# EAGLE design cdf-dual-driver (EAGLE 7.3.0)
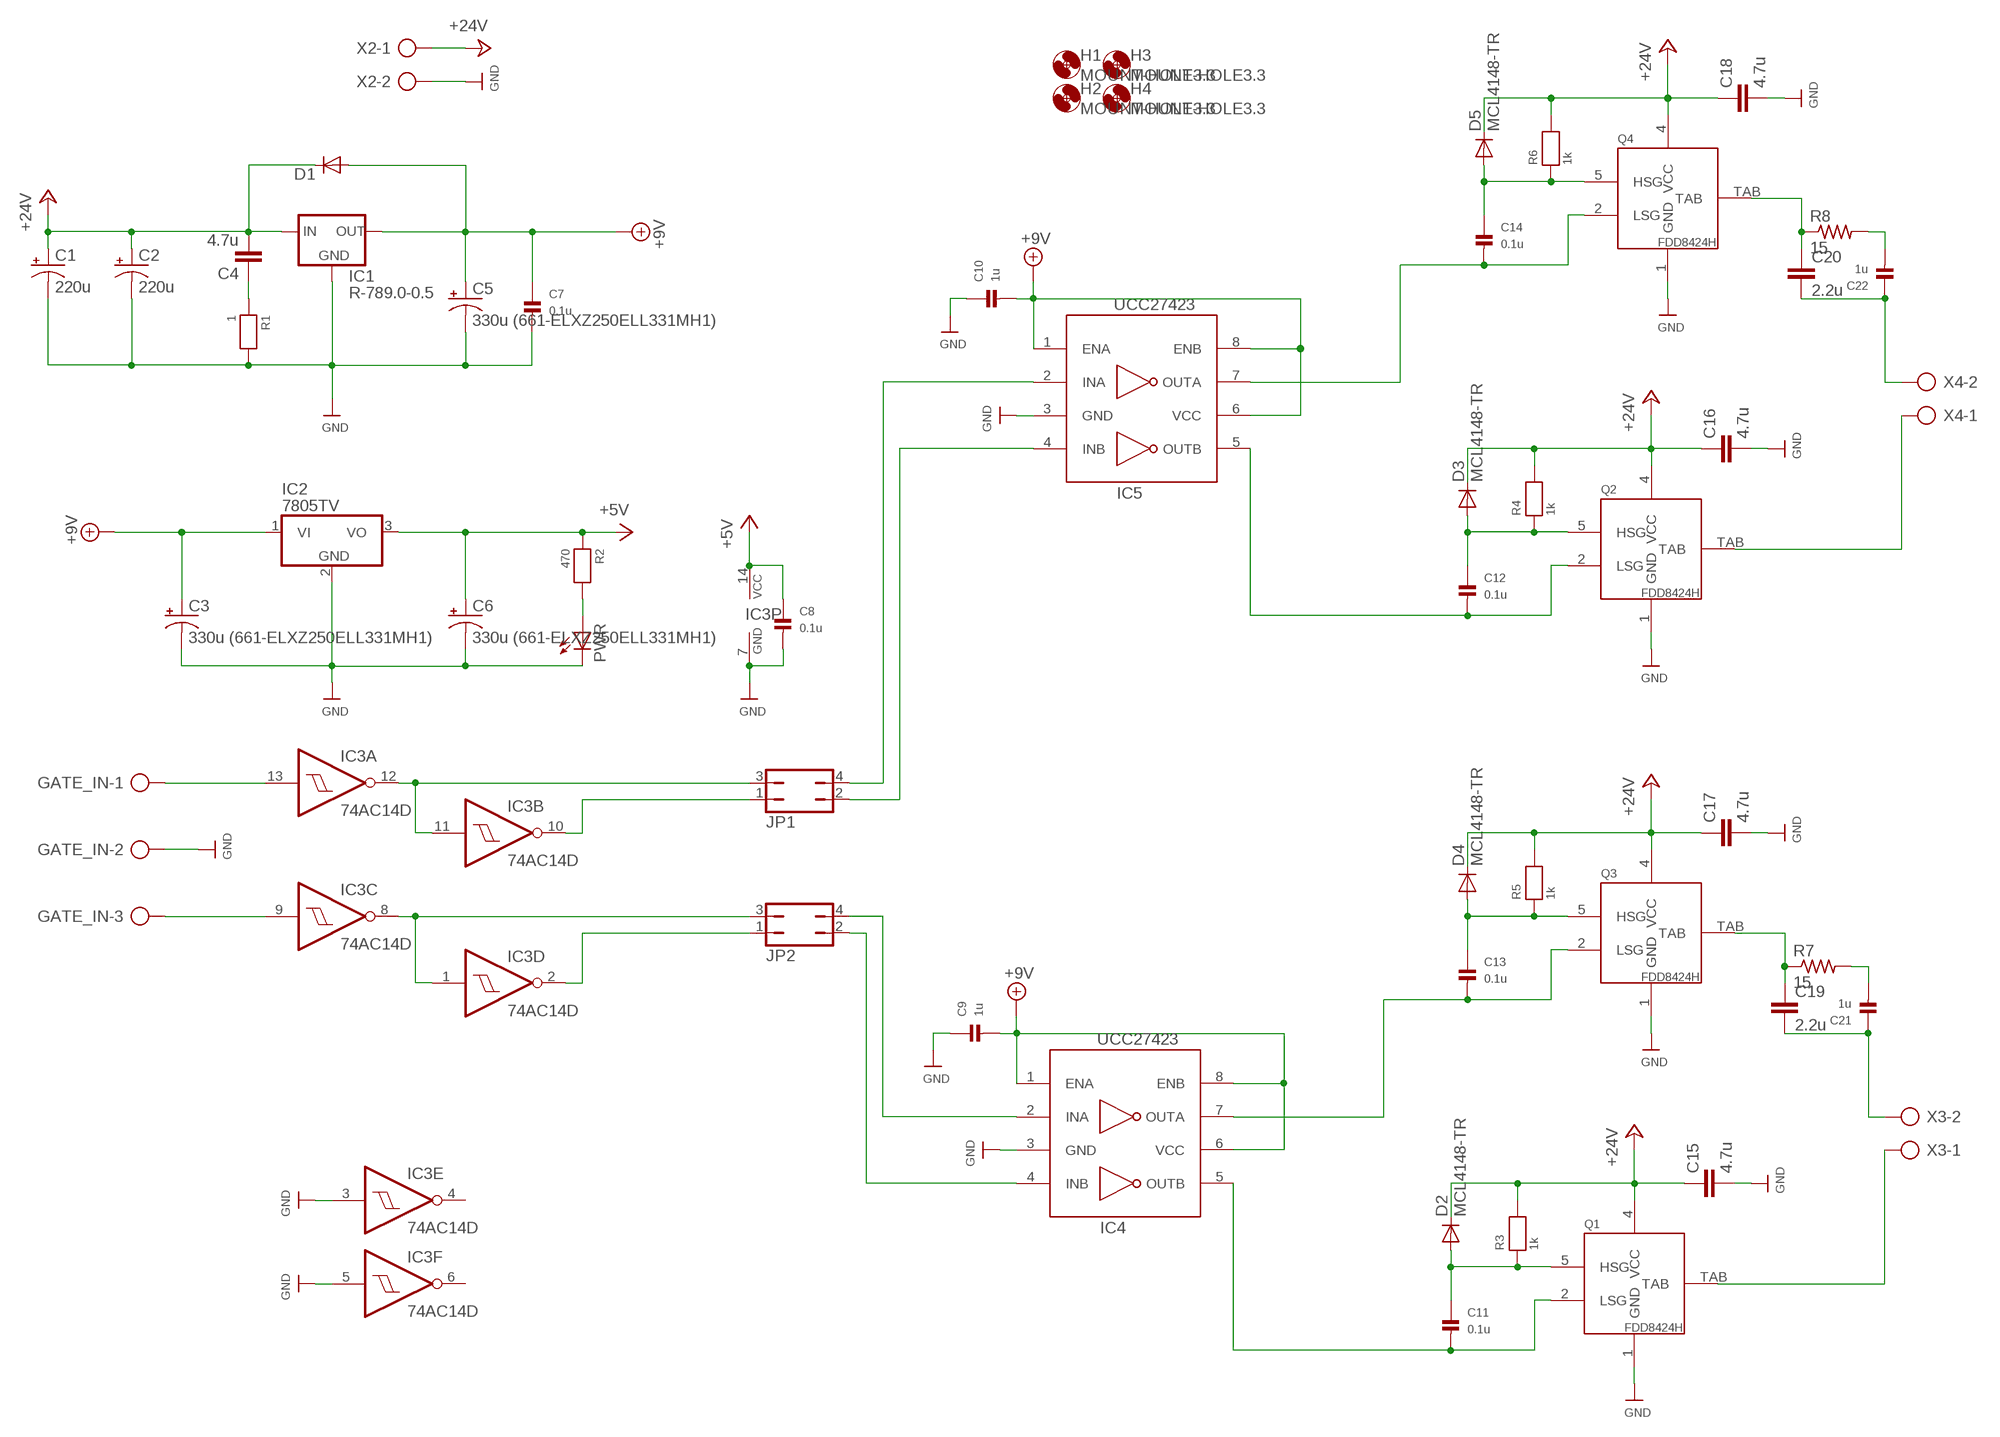
[diagram p0: schematic, sheet 1]

## Parts
C1  220u  CPOL-USE3.5-8  [E3,5-8]
C2  220u  CPOL-USE3.5-8  [E3,5-8]
C3  330u (661-ELXZ250ELL331MH1)  CPOL-USE3.5-8  [E3,5-8]
C4  4.7u  C-EUC1210  [C1210]
C5  330u (661-ELXZ250ELL331MH1)  CPOL-USE3.5-8  [E3,5-8]
C6  330u (661-ELXZ250ELL331MH1)  CPOL-USE3.5-8  [E3,5-8]
C7  0.1u  CAP_CERAMIC0805  [0805]
C8  0.1u  CAP_CERAMIC0805  [0805]
C9  1u  CAP_CERAMIC1206  [1206]
C10  1u  CAP_CERAMIC1206  [1206]
C11  0.1u  CAP_CERAMIC0805  [0805]
C12  0.1u  CAP_CERAMIC0805  [0805]
C13  0.1u  CAP_CERAMIC0805  [0805]
C14  0.1u  CAP_CERAMIC0805  [0805]
C15  4.7u  C-EUC1210  [C1210]
C16  4.7u  C-EUC1210  [C1210]
C17  4.7u  C-EUC1210  [C1210]
C18  4.7u  C-EUC1210  [C1210]
C19  2.2u  C-EUC1210  [C1210]
C20  2.2u  C-EUC1210  [C1210]
C21  1u  CAP_CERAMIC1206  [1206]
C22  1u  CAP_CERAMIC1206  [1206]
D1  DIODE-SOD123  [SOD123]
D2  MCL4148-TR  DIODE-MICROMELF-W  [MICROMELF-W]
D3  MCL4148-TR  DIODE-MICROMELF-W  [MICROMELF-W]
D4  MCL4148-TR  DIODE-MICROMELF-W  [MICROMELF-W]
D5  MCL4148-TR  DIODE-MICROMELF-W  [MICROMELF-W]
GATE_IN  AK500/3  [AK500/3]
H1  MOUNT-HOLE3.3  [3,3]
H2  MOUNT-HOLE3.3  [3,3]
H3  MOUNT-HOLE3.3  [3,3]
H4  MOUNT-HOLE3.3  [3,3]
IC1  R-789.0-0.5  [SIP3]
IC2  7805TV  [TO220V]
IC3  74AC14D  [SO14]
IC4  UCC27423  [SOIC8]
IC5  UCC27423  [SOIC8]
JP1  JP2Q  [JP2Q]
JP2  JP2Q  [JP2Q]
PWR  LED5MM  [LED5MM]
Q1  FDD8424H  [TO252-4]
Q2  FDD8424H  [TO252-4]
Q3  FDD8424H  [TO252-4]
Q4  FDD8424H  [TO252-4]
R1  1  RESISTOR0805  [0805]
R2  470  RESISTOR0805  [0805]
R3  1k  RESISTOR0805  [0805]
R4  1k  RESISTOR0805  [0805]
R5  1k  RESISTOR0805  [0805]
R6  1k  RESISTOR0805  [0805]
R7  15  R-US_R1210  [R1210]
R8  15  R-US_R1210  [R1210]
X2  AK500/2  [AK500/2]
X3  AK500/2  [AK500/2]
X4  AK500/2  [AK500/2]

## Nets
+5V: C6.+ C8.1 IC2.3(VO) IC3.14(P:VCC) R2.1
+9V: C3.+ C5.+ C7.1 C9.2 C10.2 D1.A IC1.3(OUT) IC2.1(VI) IC4.1(ENA) IC4.6(VCC) IC4.8(ENB) IC5.1(ENA) IC5.6(VCC) IC5.8(ENB)
+24V: C1.+ C2.+ C4.2 C15.1 C16.1 C17.1 C18.1 D1.C D2.C D3.C D4.C D5.C IC1.1(IN) Q1.4(VCC) Q2.4(VCC) Q3.4(VCC) Q4.4(VCC) R3.2 R4.2 R5.2 R6.2 X2.1
GND: C1.- C2.- C3.- C5.- C6.- C7.2 C8.2 C9.1 C10.1 C15.2 C16.2 C17.2 C18.2 GATE_IN.2 IC1.2(GND) IC2.2(GND) IC3.3(E:I) IC3.5(F:I) IC3.7(P:GND) IC4.3(GND) IC5.3(GND) PWR.K(C) Q1.1(GND) Q2.1(GND) Q3.1(GND) Q4.1(GND) R1.2 X2.2
N$1: C13.2 IC4.7(OUTA) Q3.2(LSG)
N$2: C13.1 D4.A Q3.5(HSG) R5.1
N$3: C14.2 IC5.7(OUTA) Q4.2(LSG)
N$4: C14.1 D5.A Q4.5(HSG) R6.1
N$5: C20.1 Q4.TAB R8.1
N$6: C22.2 R8.2
N$7: C20.2 C22.1 X4.2
N$8: C12.2 IC5.5(OUTB) Q2.2(LSG)
N$9: C12.1 D3.A Q2.5(HSG) R4.1
N$10: Q2.TAB X4.1
N$11: C4.1 R1.1
N$12: C19.1 Q3.TAB R7.1
N$13: C21.2 R7.2
N$14: C19.2 C21.1 X3.2
N$15: C11.2 IC4.5(OUTB) Q1.2(LSG)
N$16: C11.1 D2.A Q1.5(HSG) R3.1
N$17: Q1.TAB X3.1
N$18: PWR.A R2.2
N$19: IC5.2(INA) JP1.4
N$20: IC5.4(INB) JP1.2
N$21: IC4.2(INA) JP2.4
N$22: IC4.4(INB) JP2.2
N$23: IC3.11(B:I) IC3.12(A:O) JP1.3
N$24: GATE_IN.1 IC3.13(A:I)
N$25: GATE_IN.3 IC3.9(C:I)
N$26: IC3.10(B:O) JP1.1
N$27: IC3.1(D:I) IC3.8(C:O) JP2.3
N$28: IC3.2(D:O) JP2.1
Unconnected: IC3.4(E:O) IC3.6(F:O)

## Library data of the parts
C1-C3 C5 C6 = rcl:CPOL-US: POLARIZED CAPACITOR, American symbol
C4 C15-C20 = rcl:C-EU: CAPACITOR, European symbol
C7-C14 C21 C22 = microbuilder:CAP_CERAMIC: Ceramic Capacitors 0402 - 0402 Surface Mount Capacitors 16pF 50V 5% [Digikey: 445-4899-2-ND] 18pF 50V 5% [Digikey: 490-1281-2-ND] 22pF 50V 5% [Digikey: 490-1283-2-ND] 68pF 50V 5% [Digikey: 490-1289-2-ND] 0.1uF 10V 10% [Digikey: 490-1318-2-ND] 1.0uF 6.3V 10% [Digikey: 490-1320-2-ND] 0603 - 0603 Surface Mount Capacitors 16 pF 50V 5% [Digikey: 445-5051-2-ND] 22 pF 50V [Digikey: PCC220ACVTR-ND] 33 pF 50V 5% [Digikey: 490-1415-1-ND] 56pF 50V 5% [Digikey: 490-1421-1-ND] 220pF 50V 5% [Digikey: 445-1285-1-ND] 680 pF 50V 2200 pF 50V 5% C0G [Digikey: 445-1297-1-ND] 5600 pF 100V 5% X7R [Digikey: 478-3711-1-ND] 0.1 µF 25V 10% [Digikey: PCC2277TR-ND] 0.22 µF 16V 10% X7R [Digikey: 445-1318-1-ND] 1.0 µF 25V 10% [Digikey: 445-5146-2-ND] 0603 - RF Specific 3pF 250V +/-0.1pF RF [Digikey: 712-1347-1-ND] 18 pF 250V 5% [Digikey: 478-3505-1-ND or 712-1322-1-ND] 56 pF 250V 5% C0G RF [Digikey: 490-4867-1-ND] 68 pF 250V RF [Digikey: 490-4868-1-ND] 0805 - 0805 Surface Mount Capacitors 220 pF 250V 2% RF Ceramic Capacitor [Digikey: 712-1398-1-ND] 1000 pF 50V 2% NP0 Ceramic Capacitor [Digikey: 478-3760-1-ND] 0.1 µF 25V 10% Ceramic Capacitor [Digikey: PCC1828TR-ND] 1.0 µF 16V 10% Ceramic Capacitor[Digikey: 490-1691-2-ND] 10.0 µF 10V 10% Ceramic Capacitor[Digikey: 709-1228-1-ND] 10.0 uF 16V 10% Ceramic Capacitor [Digikey: 478-5165-2-ND] 47 uF 6.3V 20% Ceramic Capacitor [Digikey: 587-1779-1-ND or 399-5506-1-ND] 1206 - 1206 Surface Mount Capacitors 47uF 10V 20% Ceramic Capacitor [Digikey: 490-5528-1-ND or 399-5508-1-ND or 445-6010-1-ND] 100uF 6.3V -20%, +80% Y5V Ceramic Capacitor (Digikey: 490-4512-1-ND, Mouser: 81-GRM31CF50J107ZE1L)
D1-D5 = diode:DIODE-: DIODE
GATE_IN = con-ptr500:AK500/3: CONNECTOR; OC_FARNELL: unknown; OC_NEWARK: unknown
H1-H4 = holes:MOUNT-HOLE: MOUNTING HOLE with drill center marker
IC1 = r-78xx_10:R-78*-0.5: Innoline R-78xx-0.5 Series Switching Regulators - 0.5A, Standard Source: http://www.recom-international.com/pdf/Innoline/R-78xx-0.5.pdf; MF: Recom; MPN: R-789.0-05; OC_FARNELL: 1793145; OC_NEWARK: 62X9544
IC2 = linear:78*: Positive VOLTAGE REGULATOR Source: http://cache.national.com/ds/LM/LM78L05.pdf http://www.fairchildsemi.com/ds/LM/LM7805.pdf
IC3 = 74xx-eu:74*14: Hex schmitt trigger INVERTER
IC4 IC5 = keves:UCC27423
JP1 JP2 = jumper:JP2Q: JUMPER
PWR = led:LED: LED OSRAM: - CHIPLED LG R971, LG N971, LY N971, LG Q971, LY Q971, LO R971, LY R971 LH N974, LH R974 LS Q976, LO Q976, LY Q976 LO Q996 - Hyper CHIPLED LW Q18S LB Q993, LB Q99A, LB R99A - SideLED LS A670, LO A670, LY A670, LG A670, LP A670 LB A673, LV A673, LT A673, LW A673 LH A674 LY A675 LS A676, LA A676, LO A676, LY A676, LW A676 LS A679, LY A679, LG A679 - Hyper Micro SIDELED® LS Y876, LA Y876, LO Y876, LY Y876 LT Y87S - SmartLED LW L88C, LW L88S LB L89C, LB L89S, LG L890 LS L89K, LO L89K, LY L89K LS L896, LA L896, LO L896, LY L896 - TOPLED LS T670, LO T670, LY T670, LG T670, LP T670 LSG T670, LSP T670, LSY T670, LOP T670, LYG T670 LG T671, LOG T671, LSG T671 LB T673, LV T673, LT T673, LW T673 LH T674 LS T676, LA T676, LO T676, LY T676, LB T676, LH T676, LSB T676, LW T676 LB T67C, LV T67C, LT T67C, LS T67K, LO T67K, LY T67K, LW E67C LS E67B, LA E67B, LO E67B, LY E67B, LB E67C, LV E67C, LT E67C LW T67C LS T679, LY T679, LG T679 LS T770, LO T770, LY T770, LG T770, LP T770 LB T773, LV T773, LT T773, LW T773 LH T774 LS E675, LA E675, LY E675, LS T675 LS T776, LA T776, LO T776, LY T776, LB T776 LHGB T686 LT T68C, LB T68C - Hyper Mini TOPLED® LB M676 - Mini TOPLED Santana® LG M470 LS M47K, LO M47K, LY M47K Source: http://www.osram.convergy.de LUXEON: - LUMILED® LXK2-PW12-R00, LXK2-PW12-S00, LXK2-PW14-U00, LXK2-PW14-V00 LXK2-PM12-R00, LXK2-PM12-S00, LXK2-PM14-U00 LXK2-PE12-Q00, LXK2-PE12-R00, LXK2-PE12-S00, LXK2-PE14-T00, LXK2-PE14-U00 LXK2-PB12-K00, LXK2-PB12-L00, LXK2-PB12-M00, LXK2-PB14-N00, LXK2-PB14-P00, LXK2-PB14-Q00 LXK2-PR12-L00, LXK2-PR12-M00, LXK2-PR14-Q00, LXK2-PR14-R00 LXK2-PD12-Q00, LXK2-PD12-R00, LXK2-PD12-S00 LXK2-PH12-R00, LXK2-PH12-S00 LXK2-PL12-P00, LXK2-PL12-Q00, LXK2-PL12-R00 Source: www.luxeon.com KINGBRIGHT: KA-3528ASYC Source: www.kingbright.com
Q1-Q4 = keves:FDD8424H
R1-R6 = microbuilder:RESISTOR: Resistors 0402 - 0402 Surface Mount Package 22 Ohm 1% 1/16W [Digikey: 311-22.0LRTR-ND] 33 Ohm 5% 1/16W 1.0K 5% 1/16W 1.5K 5% 1/16W 2.0K 1% 1/16W 10.0K 1% 1/16W [Digikey: 311-10.0KLRTR-ND] 10.0K 5% 1/16W [Digikey: RMCF0402JT10K0TR-ND] 12.1K 1% 1/16W [Digikey: 311-22.0LRTR-ND] 100.0K 5% 1/16W 0603 - 0603 Surface Mount Package 0 Ohm 1/10 Watt 1% Resistor 15 Ohm 1/10 Watt 1% Resistor 33 Ohm 1/10 Watt 1% Resistor 49.9 Ohm 1/10 Watt 1% Resistor 100 Ohm 1/10 Watt 1% Resistor 150 Ohm 1/10 Watt 1% Resistor 240 Ohm 1/10 Watt 1% Resistor 390 Ohm 1/10 Watt 1% Resistor 560 Ohm 1/10 Watt 1% Resistor 680 Ohm 1/10 Watt 1% Resistor 750 Ohm 1/10 Watt 1% Resistor 1.0K Ohm 1/10 Watt 1% Resistor 1.5K Ohm 1/10 Watt 1% Resistor 2.0K Ohm 1/10 Watt 1% Resistor 2.2K Ohm 1/10 Watt 1% Resistor 3.3K Ohm 1/10 Watt 1% Resistor 4.7K Ohm 1/10 Watt 1% Resistor 10.0K Ohm 1/10 Watt 1% Resistor 12.0K Ohm 1/10 Watt 1% Resistor 12.1K Ohm 1/10 Watt 1% Resistor 20.0K Ohm 1/10 Watt 1% Resistor 33.0K Ohm 1/10 Watt 1% Resistor 100.0K Ohm 1/10 Watt 1% Resistor 0805 - 0805 Surface Mount Package 0 Ohm 1/8 Watt 1% Resistor 33 Ohm 1/8 Watt 1% Resistor 100 Ohm 1/8 Watt 1% Resistor 150 Ohm 1/8 Watt 1% Resistor 200 Ohm 1/8 Watt 1% Resistor 240 Ohm 1/8 Watt 1% Resistor 330 Ohm 1/8 Watt 1% Resistor 390 Ohm 1/8 Watt 1% Resistor 470 Ohm 1/8 Watt 1% Resistor 1.0K Ohm 1/8 Watt 1% Resistor 1.5K Ohm 1/8 Watt 1% Resistor 2.0K Ohm 1/8 Watt 1% Resistor 4.7K Ohm 1/8 Watt 1% Resistor 5.1K Ohm 1/8 Watt 1% Resistor 5.6K Ohm 1/8 Watt 1% Resistor 10.0K Ohm 1/8 Watt 1% Resistor 22.0K Ohm 1/8 Watt 1% Resistor 33.0K Ohm 1/8 Watt 1% Resistor 100K Ohm 1/8 Watt 1% Resistor 1206 - 1206 Surface Mount Package 2012 - 2010 Surface Mount Package 0.11 Ohm 1/2 Watt 1% Resistor - Digikey: RHM.11UCT-ND
R7 R8 = rcl:R-US_: RESISTOR, American symbol
X2-X4 = con-ptr500:AK500/2: CONNECTOR; OC_FARNELL: unknown; OC_NEWARK: unknown

## Board
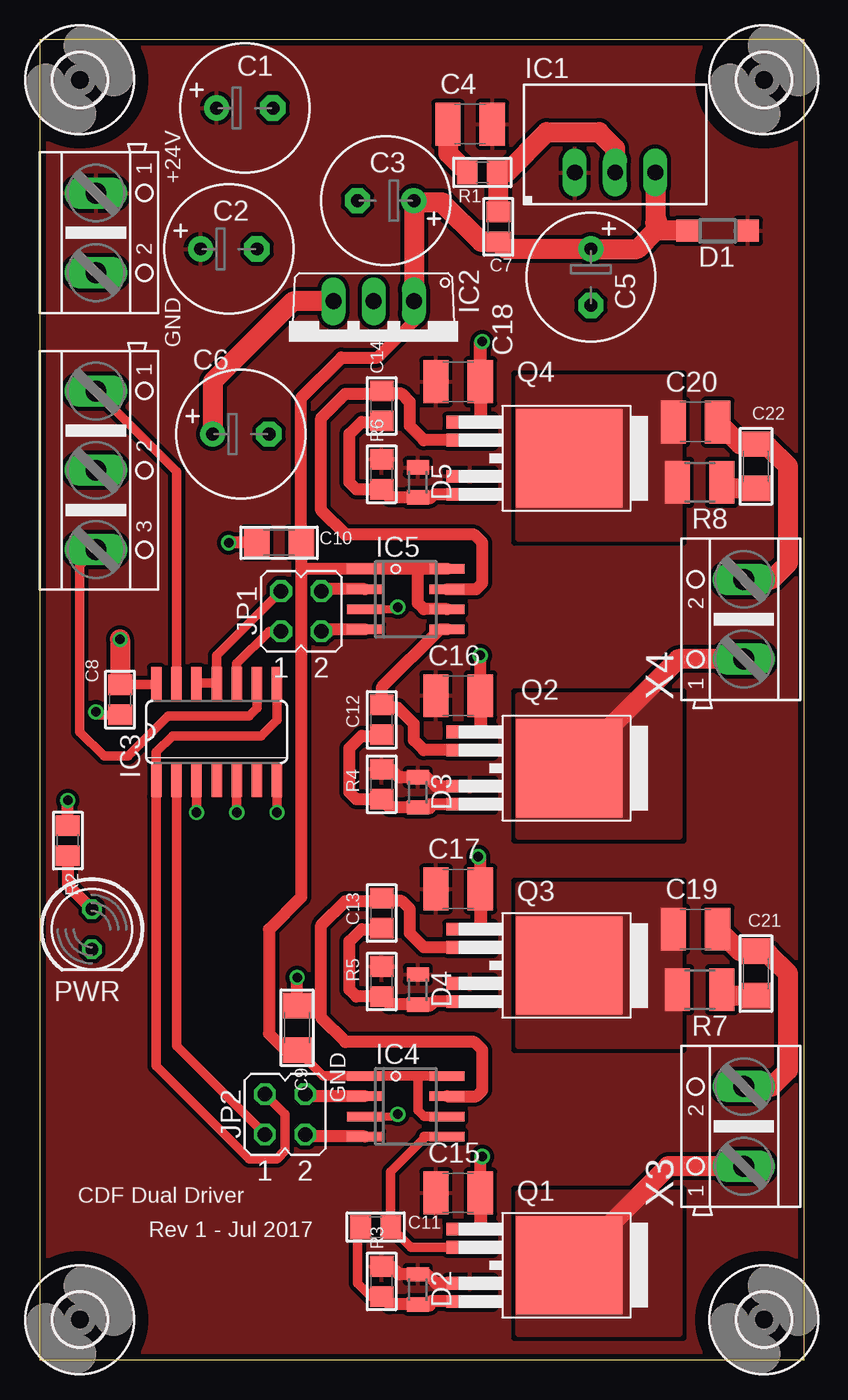
[diagram p1: board, top side]
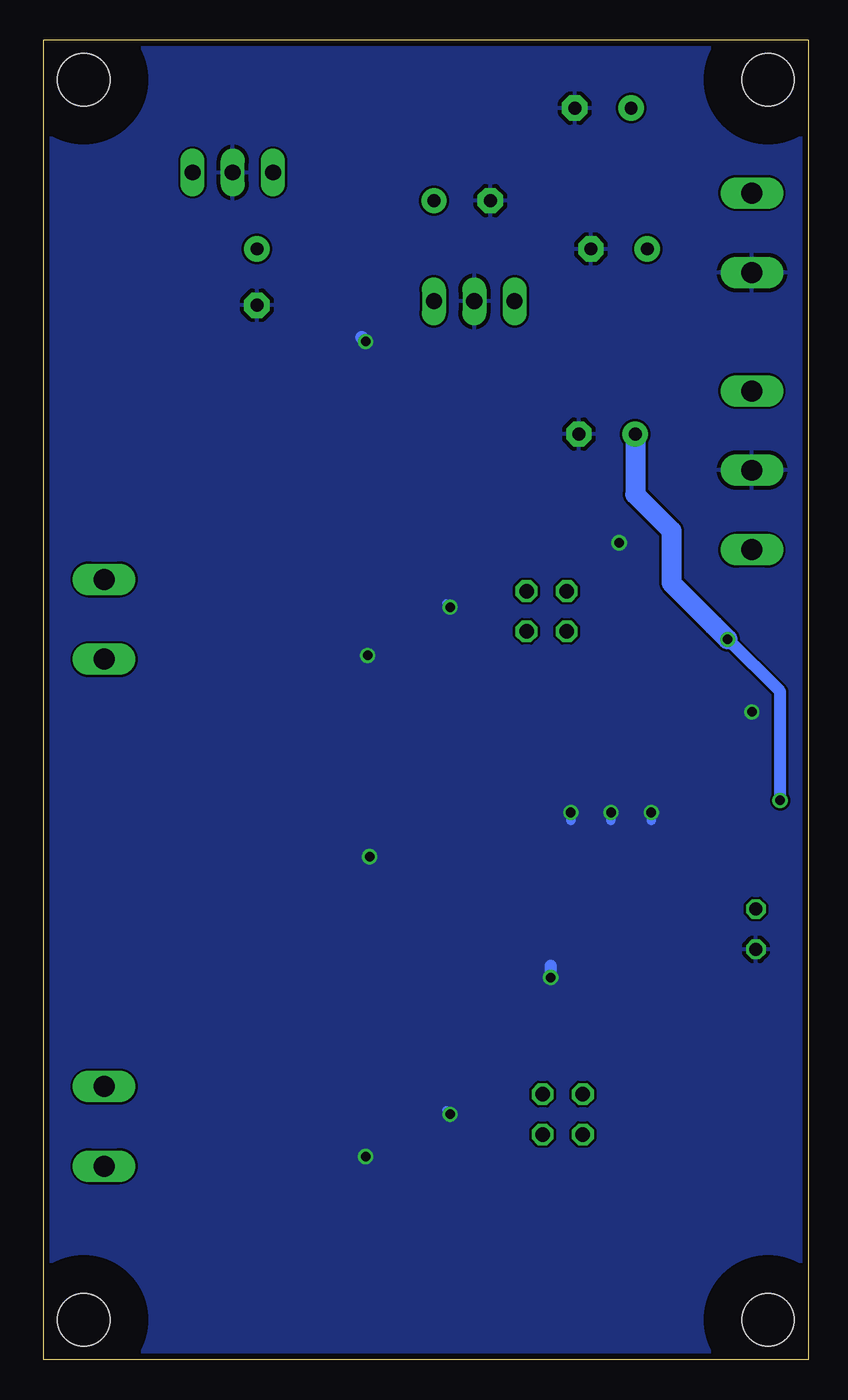
[diagram p2: board, bottom side, seen from below]

Size 48.26 x 83.31 mm. Coordinates in mm from the lower left corner, seen from the top.
Outline: 0,0 48.26,0 48.26,83.31 0,83.31 0,0
Copper layers (1*16): Top 0.0356mm / dielectric 1.5011mm / Bottom 0.0356mm
Design rules "oshpark *": minimum track width 6mil, minimum drill 13mil, track to track 6mil, track to pad 6mil, pad to pad 6mil, via to via 6mil, smd to smd 6mil, copper to edge 15mil, drill to drill 6mil, minimum pad ring 7mil, minimum via ring 7mil, stop-mask expansion 3mil, vias tented up to drill 0mil, thermal gap 10mil

### Footprints (pad centres in the part's own frame; a part is rotated, then mirrored left to right if it is on the bottom)
E3,5-8 = drill 0.813 pad 1.6: + -1.778,0 | drill 0.813 pad 1.6 octagon: - 1.778,0
C1210 = smd 1.6 x 2.7: 1 -1.4,0; 2 1.4,0
0805 = smd 1.3 x 1.5: 1 -0.95,0; 2 0.95,0
1206 = smd 1.6 x 1.8: 1 -1.4,0; 2 1.4,0
SOD123 = smd 1.4 x 1.4: A 1.9,0; C -1.9,0
MICROMELF-W = smd 0.9 x 1.4: A 0.95,0; C -0.95,0
AK500/3 = drill 1.321 long: 1 -5.004,0; 2 0,0; 3 5.004,0
3,3 = hole 3.3: 0,0
SIP3 = drill 1 long: 1 -2.54,0; 2 0,0; 3 2.54,0
TO220V = drill 1.016 long: 1 -2.54,-2.54; 2 0,-2.54; 3 2.54,-2.54
SO14 = smd 0.66 x 2.032: 1 -3.81,-3.073; 2 -2.54,-3.073; 3 -1.27,-3.073; 4 0,-3.073; 5 1.27,-3.073; 6 2.54,-3.073; 7 3.81,-3.073; 8 3.81,3.073; 9 2.54,3.073; 10 1.27,3.073; 11 0,3.073; 12 -1.27,3.073; 13 -2.54,3.073; 14 -3.81,3.073
SOIC8 = smd 0.6 x 2.2: 1 -1.905,-2.6; 2 -0.635,-2.6; 3 0.635,-2.6; 4 1.905,-2.6; 5 1.905,2.6; 6 0.635,2.6; 7 -0.635,2.6; 8 -1.905,2.6
JP2Q = drill 0.914 octagon: 1 -1.27,-1.27; 2 1.27,-1.27; 3 -1.27,1.27; 4 1.27,1.27
LED5MM = drill 0.813 octagon: A -1.27,0; K 1.27,0
TO252-4 = smd 0.8 x 3: 1 -2.28,0; 2 -1.14,0; 4 1.14,0; 5 2.28,0 | smd 6.2 x 6.7: TAB 0,6.25
R1210 = smd 1.6 x 2.7: 1 -1.4,0; 2 1.4,0
AK500/2 = drill 1.321 long: 1 -2.515,0; 2 2.515,0

### Placement (x,y rotation side)
C1  12.95,78.99 0 top
C2  11.94,70.1 0 top
C3  21.84,73.15 180 top
C4  27.18,77.98 0 top
C5  34.8,68.33 270 top
C6  12.7,58.42 0 top
C7  28.96,71.5 90 top
C8  5.08,41.66 270 top
C9  16.26,20.95 270 top
C10  15.11,51.56 0 top
C11  21.21,8.38 0 top
C12  21.59,40.39 90 top
C13  21.59,28.19 90 top
C14  21.59,60.2 90 top
C15  26.42,10.54 0 top
C16  26.42,41.91 0 top
C17  26.42,29.72 0 top
C18  26.42,61.72 0 top
C19  41.4,27.18 0 top
C20  41.4,59.18 0 top
C21  45.21,24.38 270 top
C22  45.21,56.39 270 top
D1  42.8,71.25 180 top
D2  23.88,4.45 270 top
D3  23.88,35.81 270 top
D4  23.88,23.37 270 top
D5  23.88,55.37 270 top
GATE_IN  3.56,56.13 270 top
H1  45.72,80.77 0 top
H2  45.72,2.54 0 top
H3  2.54,80.77 0 top
H4  2.54,2.54 0 top
IC1  36.32,74.93 0 top
IC2  21.08,64.26 180 top
IC3  11.18,39.62 0 top
IC4  23.11,16 270 top
IC5  23.11,48.01 270 top
JP1  16.51,47.24 0 top
JP2  15.49,15.49 0 top
PWR  3.3,27.18 270 top
Q1  27.18,5.97 270 top
Q2  27.18,37.34 270 top
Q3  27.18,24.89 270 top
Q4  27.18,56.9 270 top
R1  27.94,74.93 0 top
R2  1.78,32.77 270 top
R3  21.59,4.95 90 top
R4  21.59,36.32 90 top
R5  21.59,23.88 90 top
R6  21.59,55.88 90 top
R7  41.66,23.37 0 top
R8  41.66,55.37 0 top
X2  3.56,71.12 270 top
X3  44.45,14.73 90 top
X4  44.45,46.74 90 top

### Tracks (layer width: path | path; a pad name or v marks a point on that pad's centre or on a via)
+5V  (via drill 0.6)
  Top 0.61: C8.1 7.28,42.61 IC3.14
  Top 0.762: R2.1 v1.78,35.31
  Top 1.27: IC2.3 16,66.8 10.92,61.72 C6.+ | v5.08,45.47 C8.1
  Bottom 0.762: 5.59,45.97 5.97,46.35 | v1.78,35.31 1.78,42.16 v5.08,45.47
  Bottom 1.27: C6.+ 10.92,54.61 8.64,52.32 8.64,49.02 5.97,46.35 v5.08,45.47
+9V
  Top 0.508: IC5.1 | 23.88,17.65 23.62,17.91 | IC4.1
  Top 0.61: IC4.6 24.26,15.37 23.88,15.75 23.88,17.65 | IC4.8 23.62,17.91 IC4.1 17.9,17.91 C9.2
  Top 0.762: IC5.8 23.88,49.91 | 23.88,49.91 IC5.1 16.64,49.91 16.51,49.78 | IC5.6 24.26,47.37 23.88,47.75 23.88,49.91 | 16.51,49.78 C10.2 16.51,60.71 19.05,63.25 21.34,63.25 23.62,65.53 IC2.1 | 16.51,49.78 16.51,44.2 16.51,29.21 14.48,27.18 14.48,20.57 15.75,19.3 16,19.3 C9.2
  Top 1.27: 23.68,73.09 C3.+ | C3.+ IC2.1 | C3.+ 23.75,73.03 25.4,73.03 27.87,70.55 C7.1 29.4,70.1 C5.+ 37.72,70.1 38.86,71.25 | IC1.3 38.86,71.75 | 38.86,71.75 38.86,71.25 | 38.99,71.88 38.86,71.75 | D1.A 38.86,71.25
+24V
  Top 0.762: Q2.4 25.02,36.2 24.38,36.83 23.94,36.83 D3.C 22.67,36.76 22.1,37.34 21.66,37.34 R4.2 | Q1.4 25.02,4.83 24.38,5.46 23.94,5.46 D2.C 22.67,5.39 22.1,5.97 21.66,5.97 R3.2
  pour Top (isolate 0.254, rank 6): -3.05,93.47 53.34,93.47 53.34,-5.33 -3.05,-5.33
GND  (via drill 0.6)
  Top 0.508: IC5.3 22.48,47.37 v22.61,47.5 | IC4.3 22.48,15.37 v22.61,15.49
  Top 0.61: IC3.3 v9.91,34.54 | IC3.5 v12.45,34.54 | IC3.7 v14.99,34.54 | C8.2 3.74,40.71 v3.56,40.89
  Top 0.762: C15.2 27.82,12.7 v27.94,12.83 | C9.1 v16.26,24.13 | C10.1 v11.94,51.56 | C17.2 27.82,31.62 v27.69,31.75 | C16.2 v27.82,44.45 v27.81,44.45
  Top 0.813: Q4.1 27.69,59.18 27.82,59.31 C18.2 27.82,64.14 v27.94,64.26 | C16.2 27.82,39.75 27.94,39.62 Q2.1 | C17.2 27.82,27.31 27.69,27.18 Q3.1 | C15.2 27.82,8.38 27.94,8.26 Q1.1
  Top 1.27: C7.2 28.96,74.86 R1.2 29.46,74.93 32,77.47 35.31,77.47 36.32,76.45 IC1.2
  Bottom 0.508: v22.61,47.5 22.86,47.75 | v22.61,15.49 22.86,15.75
  Bottom 0.61: v9.91,34.54 9.91,34.04 | v12.45,34.54 12.45,34.04 | v14.99,34.54 14.99,34.04
  Bottom 0.762: v16.26,24.13 16.26,24.89
  Bottom 0.813: v27.94,64.26 28.19,64.52
  pour Bottom: -16,90.93 50.8,90.93 50.8,-3.56 -16,-3.56
N$1
  Top 0.762: Q3.2 24.26,26.03 23.37,26.92 23.37,28.45 22.86,28.96 21.78,28.96 C13.2 21.4,28.96 19.3,28.96 17.78,27.43 17.78,21.59 19.3,20.07 27.43,20.07 27.94,19.56 27.94,17.02 27.56,16.64 IC4.7
N$2
  Top 0.762: Q3.5 24.9,22.61 24.64,22.35 23.94,22.35 D4.A 22.1,22.42 R5.1 20,22.93 19.56,23.37 19.56,26.42 20.32,27.18 21.52,27.18 C13.1
N$3
  Top 0.762: Q4.2 24.26,58.04 23.37,58.93 23.37,60.45 22.86,60.96 21.78,60.96 C14.2 21.4,60.96 19.3,60.96 17.78,59.44 17.78,53.59 19.3,52.07 27.43,52.07 27.94,51.56 27.94,49.02 27.56,48.64 IC5.7
N$4
  Top 0.762: Q4.5 24.9,54.62 24.64,54.36 23.94,54.36 D5.A 22.1,54.42 R6.1 20,54.93 19.56,55.37 19.56,58.42 20.32,59.18 21.52,59.18 C14.1
N$5
  pour Top (isolate 0.254, rank 2, no thermals): 30.23,61.98 40.39,61.98 40.39,51.82 30.23,51.82
N$6
  Top 1.27: C22.2 43.44,54.99 R8.2
N$7
  Top 1.27: C20.2 44.2,57.79 C22.1 45.34,57.66 45.97,57.66 47.24,56.39 47.24,50.29 46.2,49.25 X4.2
N$8
  Top 0.762: Q2.2 24.26,38.48 23.62,39.12 23.62,40.13 22.61,41.15 21.78,41.15 C12.2 21.59,42.42 25.27,46.1 IC5.5
N$9
  Top 0.762: Q2.5 24.64,35.06 24.64,34.8 23.88,34.8 D3.A 22.1,34.86 R4.1 20,35.37 19.56,35.81 19.56,38.61 20.32,39.37 21.52,39.37 C12.1
N$10
  Top 1.27: 33.43,36.6 Q2.TAB 40.31,44.22 X4.1
  pour Top (isolate 0.254, rank 2, no thermals): 30.23,41.91 40.39,41.91 40.39,33.02 30.23,33.02
N$11
  Top 1.27: C4.1 25.78,76.14 R1.1
N$12
  pour Top (isolate 0.254, rank 2, no thermals): 30.23,29.97 40.39,29.97 40.39,19.81 30.23,19.81
N$13
  Top 1.27: C21.2 43.44,22.98 R7.2
N$14
  Top 1.27: C19.2 44.2,25.78 C21.1 45.34,25.65 45.97,25.65 47.24,24.38 47.24,18.29 46.2,17.25 X3.2
N$15
  Top 0.61: IC4.5 24.38,14.1 | 24.38,14.1 24.26,14.1 | Q1.2 23.43,7.11 C11.2 22.16,11.87 24.38,14.1
N$16
  Top 0.61: R3.1 20.89,4 20.07,4.83 20.07,8.19 C11.1
  Top 0.762: Q1.5 24.64,3.69 24.64,3.43 23.88,3.43 D2.A 22.1,3.5 R3.1
N$17
  Top 1.27: 33.43,5.23 Q1.TAB 39.68,12.22 X3.1
  pour Top (isolate 0.254, rank 2, no thermals): 30.23,10.54 40.39,10.54 40.39,1.65 30.23,1.65
N$18
  Top 0.762: R2.2 1.78,29.97 PWR.A
N$19
  Top 0.762: IC5.2 17.91,48.64 JP1.4
N$20
  Top 0.762: IC5.4 17.91,46.1 JP1.2
N$21
  Top 0.762: IC4.2 16.89,16.64 JP2.4
N$22
  Top 0.762: IC4.4 16.89,14.1 JP2.2
N$23
  Top 0.61: IC3.12 IC3.11 11.18,44.45 JP1.3
N$24
  Top 0.61: IC3.13 8.64,56.06 GATE_IN.1
N$25
  Top 0.61: IC3.9 13.72,41.15 13.21,40.64 8.13,40.64 5.59,38.1 4.06,38.1 2.54,39.62 2.54,50.11 GATE_IN.3
N$26
  Top 0.61: IC3.10 12.45,43.94 14.48,45.97 JP1.1
N$27
  Top 0.61: JP2.3 15.49,15.49 15.49,13.21 14.99,12.7 13.21,12.7 7.37,18.54 IC3.1 7.37,38.35 8.38,39.37 13.97,39.37 14.99,40.39 IC3.8
N$28
  Top 0.61: IC3.2 8.64,19.81 JP2.1

### Text on the board
tNames: +24V | GND | GND | CDF Dual Driver | Rev 1 - Jul 2017